# EasyEDA schematic 1-Schematic_LLU_PCB.json
TITLE: Sheet_1; REV: 1.0; Date: 2019-02-02; Sheet: 1/1; Drawn By: Deadmau5; Company: Your Company
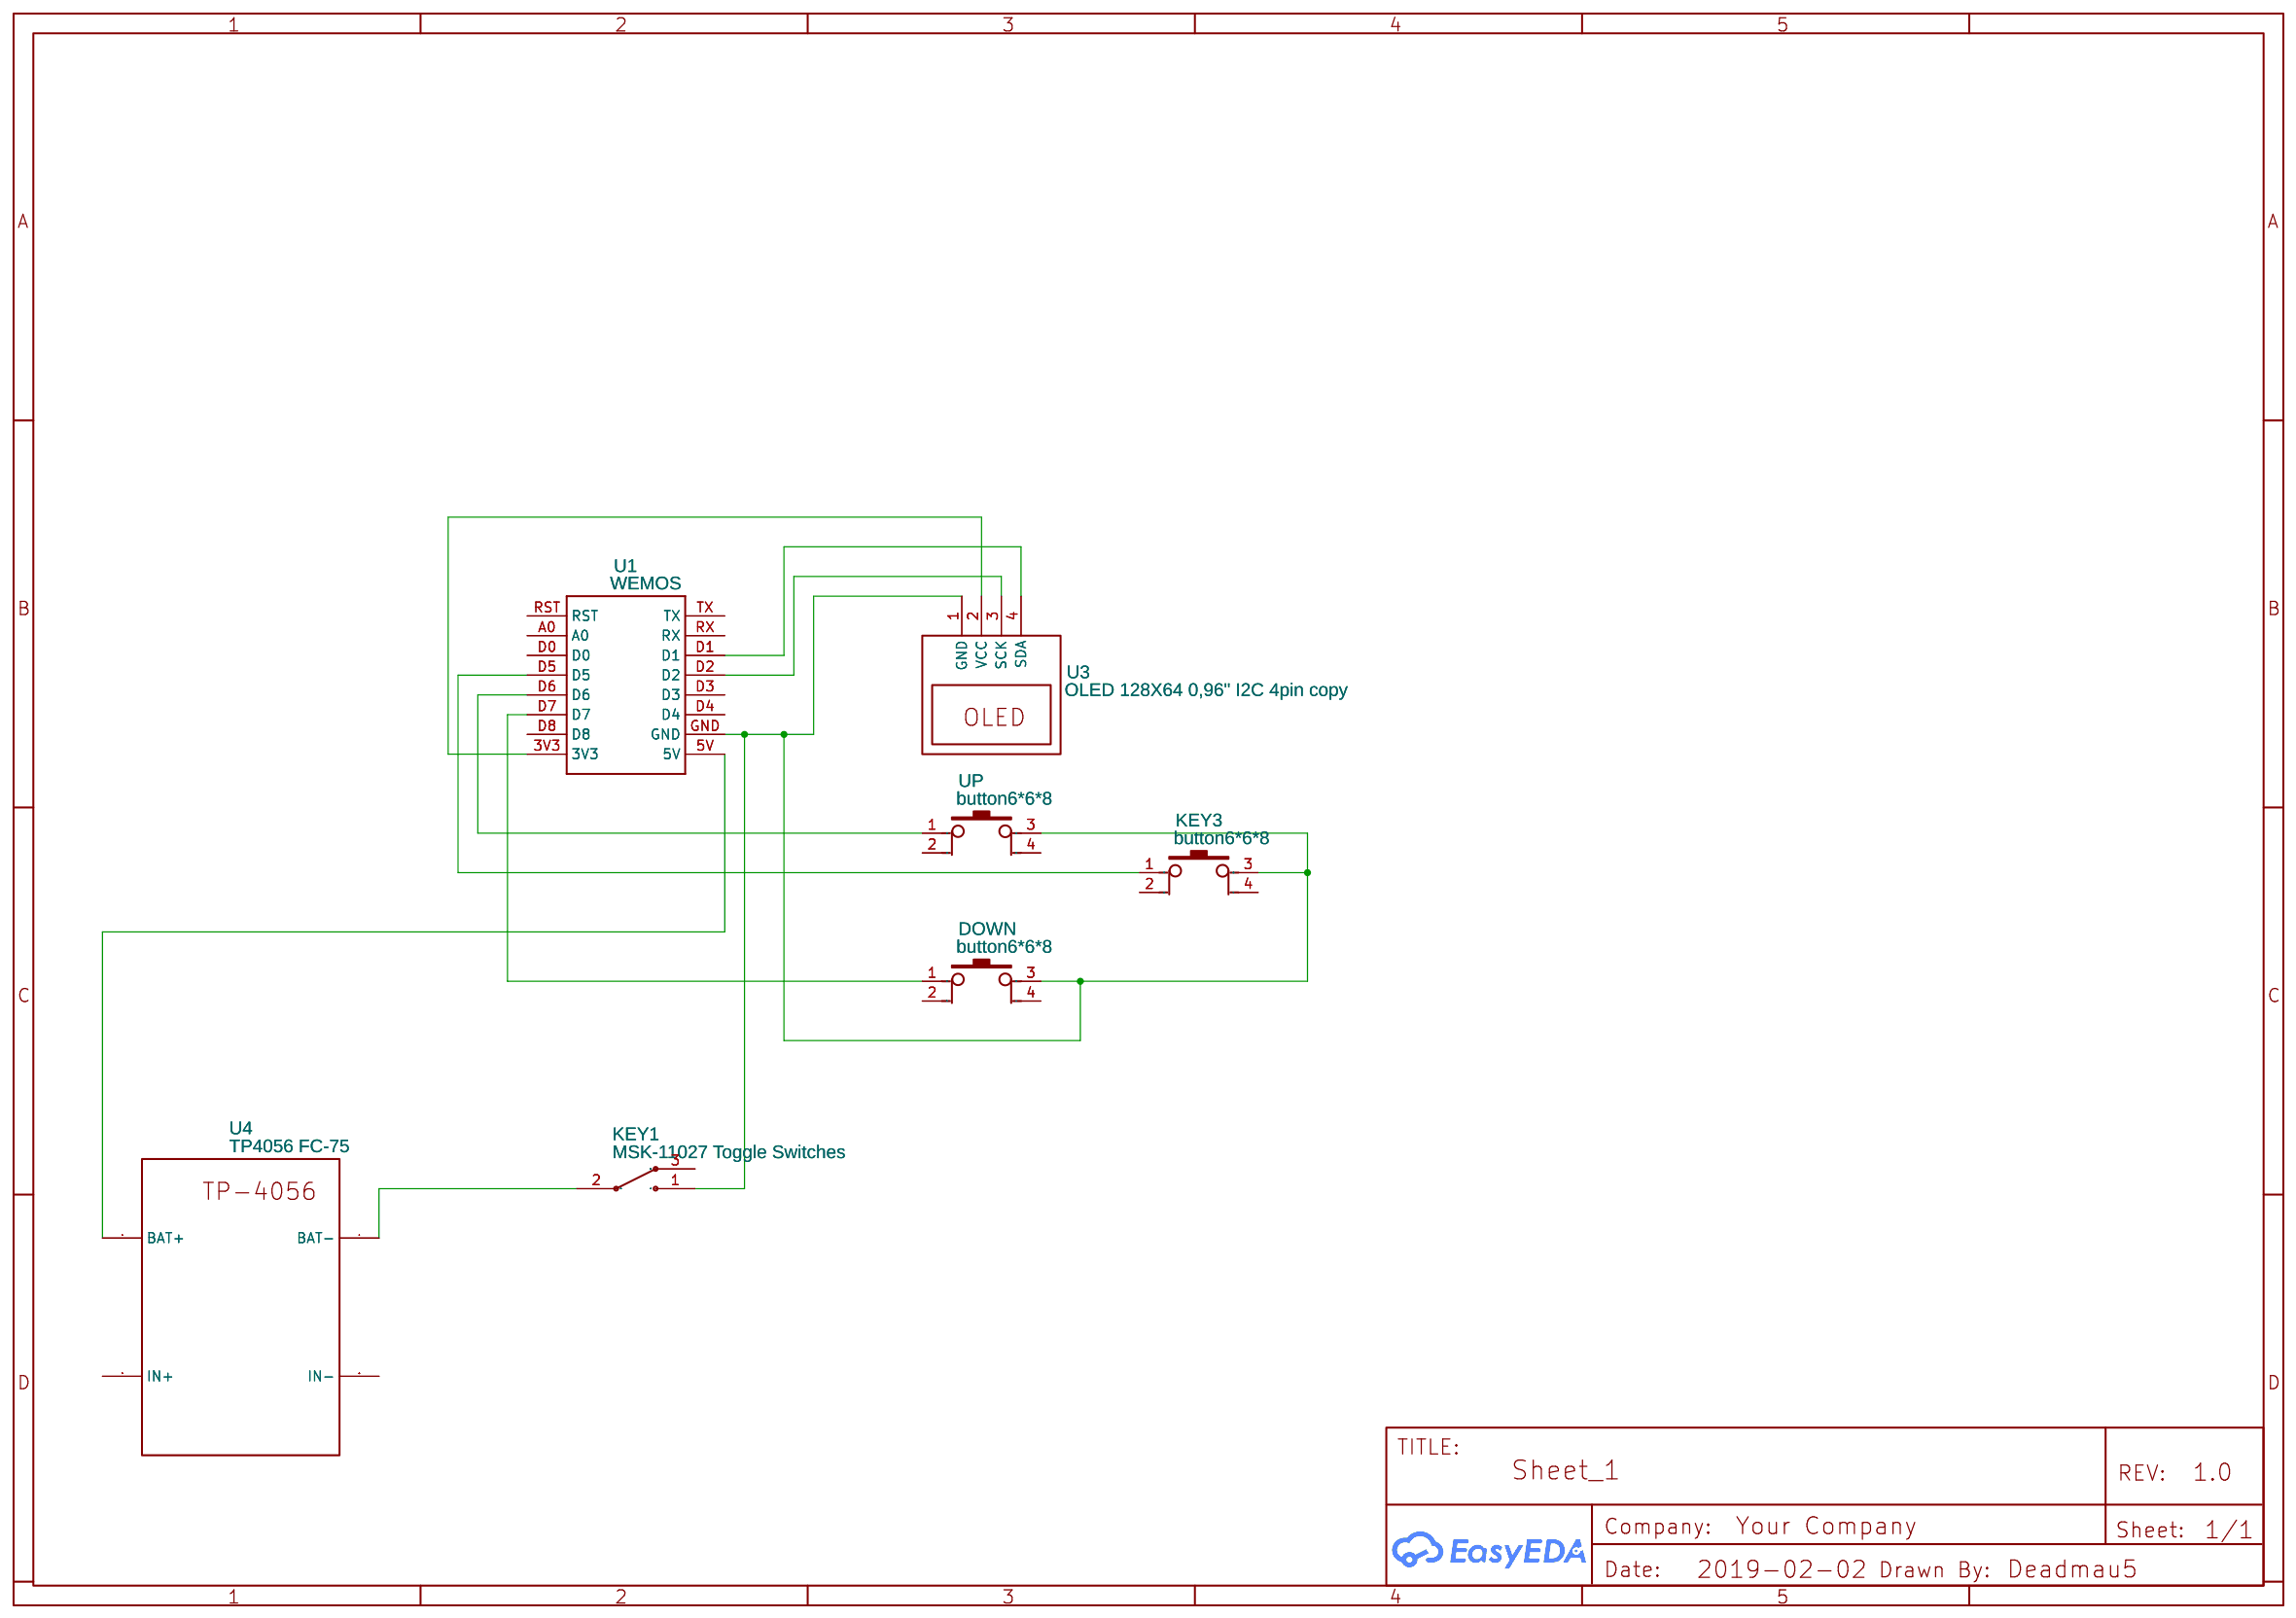
[diagram p0: schematic sheet]

## Parts
DOWN  button6*6*8  [KEY-6.0*6.0-2]
KEY1  MSK-11027 Toggle Switches  [MSK-11027]
KEY3  button6*6*8  [KEY-6.0*6.0-2]
U1  WEMOS  [WEMOS]
U3  OLED 128X64 0,96" I2C 4pin copy  [I2C - OLED 0.96" 128X64]
U4  TP4056 FC-75  [TP-4056 (FC-75)]
UP  button6*6*8  [KEY-6.0*6.0-2]

## Library data of the parts
DOWN KEY3 UP = -: Supplier Part: C59982; Supplier: LCSC; Manufacturer: ReliaPro; image: http://image.lceda.cn/szlcsc/C59982.jpg
KEY1 = -: Supplier Part: C21381; Supplier: LCSC; Manufacturer: ReliaPro; image: http://image.lceda.cn/szlcsc/C21381.jpg
U1 = -: Manufacturer Part: ?
U3 = -: Manufacturer Part: SSD1306 I2C OLED; Contributor: stozk
U4 = -: Contributor: KarlB

## Nets
Net-(DOWN-1): DOWN.1 U1.D7
Net-(DOWN-3): DOWN.3 KEY1.1 KEY3.3 U1.GND U3.1(GND) UP.3
Net-(KEY1-2): KEY1.2 U4.4(BAT-)
Net-(KEY3-1): KEY3.1 U1.D5
Net-(U1-3V3): U1.3V3 U3.2(VCC)
Net-(U1-5V): U1.5V U4.1(BAT+)
Net-(U1-D1): U1.D1 U3.4(SDA)
Net-(U1-D2): U1.D2 U3.3(SCK)
Net-(U1-D6): U1.D6 UP.1

Not connected (* = marked no-connect by the designer): DOWN 2 4; KEY1 3; KEY3 2 4; U1 A0 D0 D3 D4 D8 RST RX TX; U4 2(IN+) 3(IN-); UP 2 4
